# Altium schematic sheet 4-USB-A.SchDoc
size A4
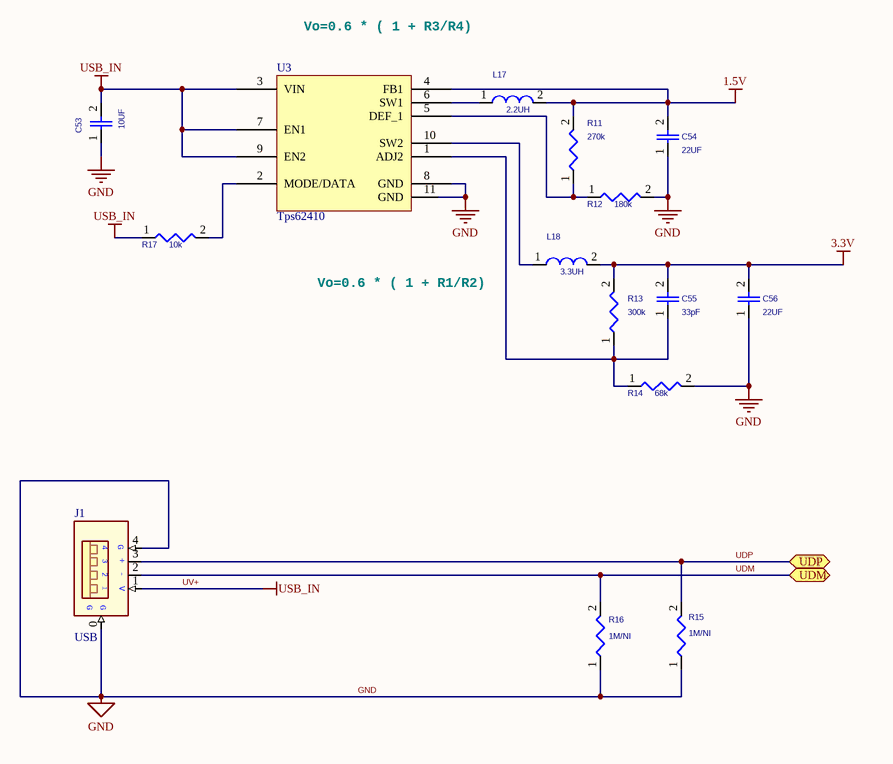
[diagram p0: 4-USB-A.SchDoc]

## Parts
C53  10UF  [0805]
C54  22UF  [0805]
C55  33pF  [0402]
C56  22UF  [0805]
J1  USB  [USB-A-MALE]
L17  2.2UH  [0806]
L18  3.3UH  [0806]
R11  270k  [0402]
R12  180k  [0402]
R13  300k  [0402]
R14  68k  [0402]
R15  1M/NI  [0402]
R16  1M/NI  [0402]
R17  10k  [0402]
U3  Tps62410  [DFN-10P-3X3]

## Ports
UDM (bidir), UDP (bidir)

## Nets
1.5V: C54.2 L17.2 R11.2 U3.4(FB1)
3.3V: C55.2 C56.2 L18.2 R13.2
GND: C53.1 C54.1 C56.1 J1.0(G) J1.4(G) R12.2 R14.2 R15.1 R16.1 U3.8(GND) U3.11(GND)
UV+: C53.2 J1.1(V+) R17.1 U3.3(VIN) U3.7(EN1) U3.9(EN2)  [also labelled USB_IN]
UDM: J1.2(D-) R16.2 ; port UDM
UDP: J1.3(D+) R15.2 ; port UDP
NetC55_1: C55.1 R13.1 R14.1 U3.1(ADJ2)
NetL17_1: L17.1 U3.6(SW1)
NetL18_1: L18.1 U3.10(SW2)
NetR11_1: R11.1 R12.1 U3.5(DEF_1)
NetR17_2: R17.2 U3.2(MODE/DATA)

## Notes on the sheet
- Vo=0.6 * ( 1 + R3/R4)
- Vo=0.6 * ( 1 + R1/R2)
- (in symbol USB) +; -; V

## Library data of the parts
C53 C54 C56 = CAP/0402: 1st Part Field: 0402
C55 = CAP/0402: 1st Part Field: 0402
L17 L18 = L/2.5*2.0
R11-R14 R17 = RES/0402_3
R15 R16 = RES/0402_2